# Altium schematic sheet Schematic_AlchemyBoxSimple_2024-01-02.schdoc
size 367 x 192 mm
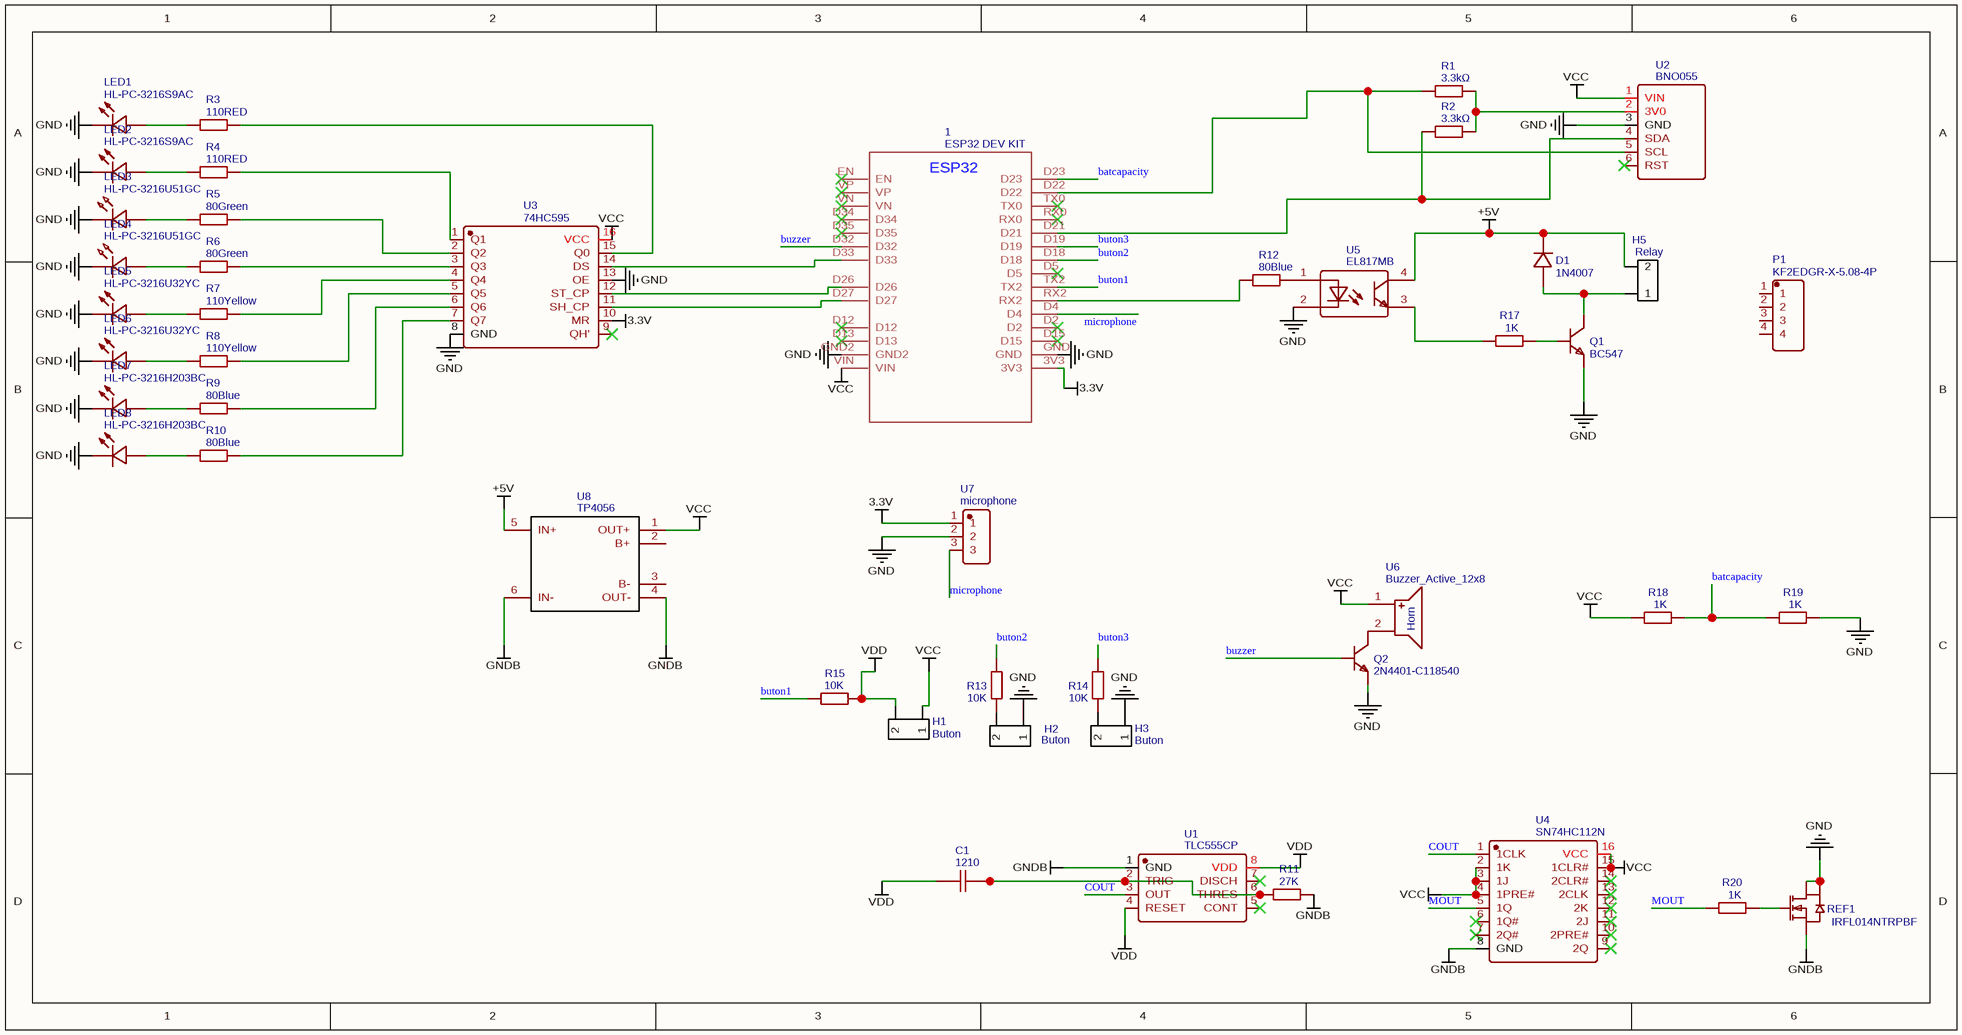
[diagram p0: Schematic_AlchemyBoxSimple_2024-01-02.schdoc]

## Parts
1  ESP32 DEV KIT  [ESP32-DEVKITV1_ESP32-DEVKITV1]
C1  1210  [C1210]
D1  1N4007  [DO-41_BD2.4-L4.7-P8.70-D0.9-RD]
H1  Buton  [CONNECTOR_PINHEADER_2.54MM:PINHEADER_1X11_P_2.54MM]
H2  Buton  [CONNECTOR_PINHEADER_2.54MM:PINHEADER_1X11_P_2.54MM]
H3  Buton  [CONNECTOR_PINHEADER_2.54MM:PINHEADER_1X11_P_2.54MM]
H5  Relay  [CONNECTOR_PINHEADER_2.54MM:PINHEADER_1X11_P_2.54MM]
LED1  HL-PC-3216S9AC  [LED1206-R-RD_RED]
LED2  HL-PC-3216S9AC  [LED1206-R-RD_RED]
LED3  HL-PC-3216U51GC  [LED1206-RD_GREEN]
LED4  HL-PC-3216U51GC  [LED1206-RD_GREEN]
LED5  HL-PC-3216U32YC  [LED1206-RD_YELLOW-1]
LED6  HL-PC-3216U32YC  [LED1206-RD_YELLOW-1]
LED7  HL-PC-3216H203BC  [LED1206-R-RD_BLUE]
LED8  HL-PC-3216H203BC  [LED1206-R-RD_BLUE]
P1  KF2EDGR-X-5.08-4P  [CONN-TH_4P-P5.08_KF2EDGR-X-5.08-4P]
Q1  BC547  [TO-92-3_L4.5-W3.5-P1.27-L]
Q2  2N4401-C118540  [TO-92-3_L4.9-W3.7-P1.27-L]
R1  3.3kΩ  [R0805]
R2  3.3kΩ  [R0805]
R3  110RED  [R0805]
R4  110RED  [R0805]
R5  80Green  [R0805]
R6  80Green  [R0805]
R7  110Yellow  [R0805]
R8  110Yellow  [R0805]
R9  80Blue  [R0805]
R10  80Blue  [R0805]
R11  27K  [R0805]
R12  80Blue  [R0805]
R13  10K  [R0805]
R14  10K  [R0805]
R15  10K  [R0805]
R17  1K  [R0805]
R18  1K  [R0805]
R19  1K  [R0805]
R20  1K  [R0805]
REF1  IRFL014NTRPBF  [SOT-223-4_L6.5-W3.5-P2.30-LS7.0-BR]
U1  TLC555CP  [DIP-8_L9.7-W6.4-P2.54-LS7.6-BL]
U2  BNO055  [ADAFRUIT-BNO055]
U3  74HC595  [74HC595]
U4  SN74HC112N  [PDIP-16_L19.3-W6.4-P2.54-LS7.9-BL]
U5  EL817MB  [DIP-4_L6.5-W4.6-P2.54-LS10.2-BL]
U6  Buzzer_Active_12x8  [BUZZER_ACTIVE_12X8]
U7  microphone  [HDR-TH_3P-P2.54-V-M-1]
U8  TP4056  [TP4056]

## Nets
3.3V: 1.3V3 U3.10(MR) U7.1
+5V: D1.1(K) H5.2 U5.4(COL) U8.5(IN+)
GND: 1.GND 1.GND2 H2.1 H3.1 LED1.2(K) LED2.2(K) LED3.1 LED4.1 LED5.1(C) LED6.1(C) LED7.2(K) LED8.2(K) Q1.3(E) Q2.1(E) R19.1 REF1.2(D) REF1.4(D) U2.3(GND) U3.8(GND) U3.13(OE) U5.2(CAT) U7.2
GNDB: R11.2 REF1.3(S) U1.1(GND) U4.8(GND) U8.4(OUT-) U8.6(IN-)
VCC: 1.VIN H1.1 R18.2 U2.1(VIN) U3.16(VCC) U4.2(1K) U4.3(1J) U4.4(1PRE#) U4.15(1CLR#) U4.16(VCC) U6.1 U8.1(OUT+)
VDD: C1.1 H1.2 R15.1 U1.4(RESET) U1.8(VDD)
batcapacity: 1.D23 R18.1 R19.2
buton1: 1.TX2 R15.2
buton2: 1.D18 R13.1
buton3: 1.D19 R14.1
buzzer: 1.D32 Q2.2(B)
COUT: U1.3(OUT) U4.1(1CLK)
microphone: 1.D4 U7.3
MOUT: R20.2 U4.5(1Q)
Net1_D21: 1.D21 R2.1 U2.4(SDA)
Net1_D22: 1.D22 R1.1 U2.5(SCL)
Net1_D26: 1.D26 U3.12(ST_CP)
Net1_D27: 1.D27 U3.11(SH_CP)
Net1_D33: 1.D33 U3.14(DS)
Net1_RX2: 1.RX2 R12.1
NetC1_2: C1.2 R11.1 U1.2(TRIG) U1.6(THRES)
NetD1_2: D1.2(A) H5.1 Q1.1(C)
NetH2_2: H2.2 R13.2
NetH3_2: H3.2 R14.2
NetLED1_1: LED1.1(A) R3.1
NetLED2_1: LED2.1(A) R4.1
NetLED3_2: LED3.2 R5.1
NetLED4_2: LED4.2 R6.1
NetLED5_2: LED5.2(A) R7.1
NetLED6_2: LED6.2(A) R8.1
NetLED7_1: LED7.1(A) R9.1
NetLED8_1: LED8.1(A) R10.1
NetQ1_2: Q1.2(B) R17.1
NetQ2_3: Q2.3(C) U6.2
NetR1_2: R1.2 R2.2 U2.2(3V0)
NetR3_2: R3.2 U3.15(Q0)
NetR4_2: R4.2 U3.1(Q1)
NetR5_2: R5.2 U3.2(Q2)
NetR6_2: R6.2 U3.3(Q3)
NetR7_2: R7.2 U3.4(Q4)
NetR8_2: R8.2 U3.5(Q5)
NetR9_2: R9.2 U3.6(Q6)
NetR10_2: R10.2 U3.7(Q7)
NetR12_2: R12.2 U5.1(AN)
NetR17_2: R17.2 U5.3(EM)
NetR20_1: R20.1 REF1.1(G)

Not connected (* = marked no-connect by the designer): 1 D2* D5* D12* D13* D15* D34* D35* EN* RX0* TX0* VN* VP*; P1 1 2 3 4; U1 5(CONT)* 7(DISCH)*; U2 6(RST)*; U3 9(QH')*; U4 6(1Q#)* 7(2Q#)* 9(2Q)* 10(2PRE#)* 11(2J)* 12(2K)* 13(2CLK)* 14(2CLR#)*; U8 2(B+) 3(B-)

## Notes on the sheet
- (in symbol Buzzer_Active_12x8) Horn
- (in symbol ESP32 DEV KIT) ESP32

## Library data of the parts
1 = ESP32 DEV KIT: Contributor: u18040382; spicePre: ?; spiceSymbolName: ESP32-DEVKIT-V1-30PIN
C1 = 1210: Manufacturer: null; Contributor: lcsc; Supplier: LCSC; Supplier Part: C9900018278; Manufacturer Part: 1210; JLCPCB Part Class: Extended Part; link: https://lcsc.com/eda_search?q=C9900018278&%26type=1&ref=editor; spicePre: C; spiceSymbolName: 1210
D1 = 1N4007: Manufacturer: ST(先科); Supplier: LCSC; Manufacturer Part: 1N4007; Supplier Part: C106903; JLCPCB Part Class: Extended Part; link: https://lcsc.com/eda_search?q=C106903&%26type=1&ref=editor; spicePre: D; spiceSymbolName: 1N4007
H1-H3 = Buton: Manufacturer: BOOMELE; Manufacturer Part: Female headerHDR1X8-2.54; Contributor: kafikangi.m; Supplier Part: C27438; JLCPCB Part Class: Extended Part; spicePre: P; spiceSymbolName: HEADER PAD 2X
H5 = Relay: Manufacturer: BOOMELE; Manufacturer Part: Female headerHDR1X8-2.54; Contributor: kafikangi.m; Supplier Part: C27438; JLCPCB Part Class: Extended Part; spicePre: P; spiceSymbolName: HEADER PAD 2X
LED1 LED2 = HL-PC-3216S9AC: Manufacturer: HONGLITRONIC(鸿利光电); Contributor: edfed; Supplier: LCSC; Supplier Part: C499470; Manufacturer Part: HL-PC-3216S9AC; JLCPCB Part Class: Extended Part; spicePre: L; spiceSymbolName: HL-PC-3216S9AC
LED3 LED4 = HL-PC-3216U51GC: Manufacturer: HONGLITRONIC(鸿利光电); Contributor: LCSC; Supplier: LCSC; Supplier Part: C499467; Manufacturer Part: HL-PC-3216U51GC; JLCPCB Part Class: Extended Part; link: https://lcsc.com/eda_search?q=C499467&%26type=1&ref=editor; spicePre: L; spiceSymbolName: HL-PC-3216U51GC
LED5 LED6 = HL-PC-3216U32YC: Manufacturer: HONGLITRONIC(鸿利光电); Contributor: LCSC; Supplier: LCSC; Supplier Part: C499469; Manufacturer Part: HL-PC-3216U32YC; JLCPCB Part Class: Extended Part; link: https://lcsc.com/eda_search?q=C499469&%26type=1&ref=editor; spicePre: L; spiceSymbolName: HL-PC-3216U32YC
LED7 LED8 = HL-PC-3216H203BC: Manufacturer: HONGLITRONIC(鸿利光电); Contributor: LCSC; Supplier: LCSC; Supplier Part: C500012; Manufacturer Part: HL-PC-3216H203BC; JLCPCB Part Class: Extended Part; link: https://lcsc.com/eda_search?q=C500012&%26type=1&ref=editor; spicePre: L; spiceSymbolName: HL-PC-3216H203BC
P1 = KF2EDGR-X-5.08-4P: Manufacturer: null; Contributor: LCSC; Supplier: LCSC; Supplier Part: C9900004068; Manufacturer Part: KF2EDGR-X-5.08-4P; JLCPCB Part Class: Extended Part; link: https://lcsc.com/eda_search?q=C9900004068&%26type=1&ref=editor; spicePre: P; spiceSymbolName: KF2EDGR-X-5.08-4P
Q1 = BC547: Manufacturer: CJ(江苏长电/长晶); Contributor: LCSC; Supplier: LCSC; Supplier Part: C2910381; Manufacturer Part: BC547; JLCPCB Part Class: Extended Part; link: https://lcsc.com/eda_search?q=C2910381&%26type=1&ref=editor; spicePre: Q; spiceSymbolName: BC547
Q2 = 2N4401-C118540: Manufacturer: ST(先科); Manufacturer Part: 2N4401; Contributor: 立创EDA官方封装库; Supplier: LCSC; Supplier Part: C118540; JLCPCB Part Class: Extended Part; link: https://lcsc.com/eda_search?q=C118540&%26type=1&ref=editor; spicePre: Q; spiceSymbolName: 2N4401-C118540
R1 R2 = 3.3kΩ: Manufacturer: Tyohm(幸亚电阻); Manufacturer Part: RMC08053.3K1%N; nameAlias: Value; Contributor: LCSC; Supplier: LCSC; Supplier Part: C269541; JLCPCB Part Class: Extended Part; link: https://lcsc.com/eda_search?q=C269541&%26type=1&ref=editor; spicePre: R; spiceSymbolName: RMC08053.3K1%N
R3 R4 = 110RED: Manufacturer: YAGEO(国巨); Manufacturer Part: RT0805FRD07100RL; nameAlias: Value; Contributor: LCSC; Supplier: LCSC; Supplier Part: C143843; JLCPCB Part Class: Extended Part; link: https://lcsc.com/eda_search?q=C143843&%26type=1&ref=editor; spicePre: R; spiceSymbolName: RT0805FRD07100RL
R5 R6 = 80Green: Manufacturer: YAGEO(国巨); Manufacturer Part: RT0805FRD07100RL; nameAlias: Value; Contributor: LCSC; Supplier: LCSC; Supplier Part: C143843; JLCPCB Part Class: Extended Part; link: https://lcsc.com/eda_search?q=C143843&%26type=1&ref=editor; spicePre: R; spiceSymbolName: RT0805FRD07100RL
R7 R8 = 110Yellow: Manufacturer: YAGEO(国巨); Manufacturer Part: RT0805FRD07100RL; nameAlias: Value; Contributor: LCSC; Supplier: LCSC; Supplier Part: C143843; JLCPCB Part Class: Extended Part; link: https://lcsc.com/eda_search?q=C143843&%26type=1&ref=editor; spicePre: R; spiceSymbolName: RT0805FRD07100RL
R9 R10 R12 = 80Blue: Manufacturer: YAGEO(国巨); Manufacturer Part: RT0805FRD07100RL; nameAlias: Value; Contributor: LCSC; Supplier: LCSC; Supplier Part: C143843; JLCPCB Part Class: Extended Part; link: https://lcsc.com/eda_search?q=C143843&%26type=1&ref=editor; spicePre: R; spiceSymbolName: RT0805FRD07100RL
R11 = 27K: Manufacturer: YAGEO(国巨); Manufacturer Part: RT0805FRD07100RL; nameAlias: Value; Contributor: LCSC; Supplier: LCSC; Supplier Part: C143843; JLCPCB Part Class: Extended Part; link: https://lcsc.com/eda_search?q=C143843&%26type=1&ref=editor; spicePre: R; spiceSymbolName: RT0805FRD07100RL
R13-R15 = 10K: Manufacturer: YAGEO(国巨); Manufacturer Part: RT0805FRD07100RL; nameAlias: Value; Contributor: LCSC; Supplier: LCSC; Supplier Part: C143843; JLCPCB Part Class: Extended Part; link: https://lcsc.com/eda_search?q=C143843&%26type=1&ref=editor; spicePre: R; spiceSymbolName: RT0805FRD07100RL
R17-R20 = 1K: Manufacturer: YAGEO(国巨); Manufacturer Part: RT0805FRD07100RL; nameAlias: Value; Contributor: LCSC; Supplier: LCSC; Supplier Part: C143843; JLCPCB Part Class: Extended Part; link: https://lcsc.com/eda_search?q=C143843&%26type=1&ref=editor; spicePre: R; spiceSymbolName: RT0805FRD07100RL
REF1 = IRFL014NTRPBF: Manufacturer: Infineon(英飞凌); Contributor: lcsc; 3DModel: SOT-223-4P_L6.5-W3.5-H1.6-LS7.0-P2.30; Supplier: LCSC; Manufacturer Part: IRFL014NTRPBF; Supplier Part: C57685; JLCPCB Part Class: Extended Part; link: https://lcsc.com/eda_search?q=C57685&%26type=1&ref=editor; spicePre: R; spiceSymbolName: IRFL014NTRPBF
U1 = TLC555CP: Manufacturer: TI(德州仪器); Contributor: LCSC; Supplier: LCSC; Supplier Part: C910886; Manufacturer Part: TLC555CP; JLCPCB Part Class: Extended Part; link: https://lcsc.com/eda_search?q=C910886&%26type=1&ref=editor; spicePre: U; spiceSymbolName: TLC555CP
U2 = BNO055: Contributor: thipawan2112; spicePre: U; spiceSymbolName: BNO055
U3 = 74HC595: Contributor: Thar Lin Htin; spicePre: U; spiceSymbolName: 74HC595
U4 = SN74HC112N: Manufacturer: TI(德州仪器); Contributor: LCSC; Supplier: LCSC; Supplier Part: C1523181; Manufacturer Part: SN74HC112N; link: https://lcsc.com/eda_search?q=C1523181&%26type=1&ref=editor; spicePre: U; spiceSymbolName: SN74HC112N
U5 = EL817MB: Manufacturer: EVERLIGHT(亿光); Contributor: LCSC; Supplier: LCSC; Supplier Part: C2912098; Manufacturer Part: EL817MB; JLCPCB Part Class: Extended Part; link: https://lcsc.com/eda_search?q=C2912098&%26type=1&ref=editor; spicePre: U; spiceSymbolName: EL817MB
U6 = Buzzer_Active_12x8: Contributor: jnnganga; spicePre: U; spiceSymbolName: Buzzer_Active_12x8
U7 = microphone: Manufacturer: null; Manufacturer Part: 2.54mm-1*3P 直针; Contributor: lcsc; Supplier: LCSC; Supplier Part: C9900025313; JLCPCB Part Class: Extended Part; link: https://lcsc.com/eda_search?q=C9900025313&%26type=1&ref=editor; spicePre: U; spiceSymbolName: 2.54MM-1*3P 直针
U8 = TP4056: Contributor: jonathan.rama2005; spicePre: U; spiceSymbolName: TP4056